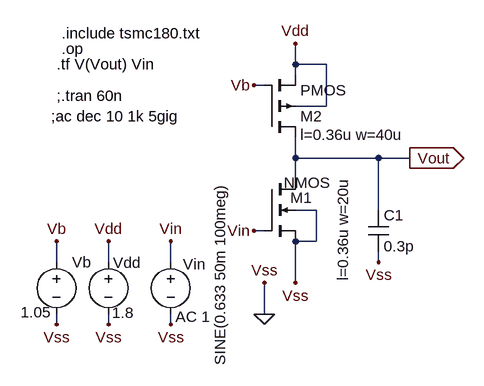
[diagram p0: schematic CS_amp with current source with 1Ghz.asc]
CS_amp with current source with 1Ghz.asc, the LTspice schematic file:
Version 4
SHEET 1 1056 680
WIRE 496 -96 496 -128
WIRE 544 -96 496 -96
WIRE 496 -80 496 -96
WIRE 448 -64 432 -64
WIRE 544 -32 544 -96
WIRE 544 -32 496 -32
WIRE 496 48 496 16
WIRE 624 48 496 48
WIRE 672 48 624 48
WIRE 496 80 496 48
WIRE 528 128 496 128
WIRE 624 128 624 48
WIRE 448 160 432 160
WIRE 528 176 528 128
WIRE 528 176 496 176
WIRE 128 208 128 176
WIRE 208 208 208 176
WIRE 304 208 304 176
WIRE 624 208 624 192
WIRE 496 240 496 176
WIRE 448 288 448 240
WIRE 128 304 128 288
WIRE 208 304 208 288
WIRE 304 304 304 288
FLAG 448 288 0
FLAG 448 240 Vss
FLAG 304 176 Vin
FLAG 208 304 Vss
FLAG 304 304 Vss
FLAG 208 176 Vdd
FLAG 496 -128 Vdd
FLAG 496 240 Vss
FLAG 672 48 Vout
IOPIN 672 48 Out
FLAG 624 208 Vss
FLAG 432 160 Vin
FLAG 432 -64 Vb
FLAG 128 304 Vss
FLAG 128 176 Vb
SYMBOL nmos4 448 80 R0
WINDOW 0 40 29 Left 2
WINDOW 3 30 6 Left 2
WINDOW 123 121 -2 VRight 2
SYMATTR InstName M1
SYMATTR Value2 l=0.36u w=20u
SYMBOL voltage 208 192 R0
WINDOW 123 0 0 Left 0
WINDOW 39 0 0 Left 0
WINDOW 0 7 17 Left 2
WINDOW 3 6 94 Left 2
SYMATTR InstName Vdd
SYMATTR Value 1.8
SYMBOL voltage 304 192 R0
WINDOW 0 19 19 Left 2
WINDOW 3 76 -106 VRight 2
WINDOW 123 7 100 Left 2
WINDOW 39 0 0 Left 0
SYMATTR InstName Vin
SYMATTR Value SINE(0.633 50m 100meg)
SYMATTR Value2 AC 1
SYMBOL cap 608 128 R0
SYMATTR InstName C1
SYMATTR Value 0.3p
SYMBOL pmos4 448 16 M180
WINDOW 123 56 4 Left 2
SYMATTR Value2 l=0.36u w=40u
SYMATTR InstName M2
SYMBOL voltage 128 192 R0
WINDOW 123 0 0 Left 0
WINDOW 39 0 0 Left 0
WINDOW 3 -55 93 Left 2
SYMATTR Value 1.05
SYMATTR InstName Vb
TEXT 136 -144 Left 2 !.include tsmc180.txt
TEXT 136 -120 Left 2 !.op
TEXT 128 -96 Left 2 !.tf V(Vout) Vin
TEXT 120 -16 Left 2 !;ac dec 10 1k 5gig
TEXT 128 -48 Left 2 !;.tran 60n

The netlist it stands for:
* CS_amp with current source with 1Ghz.asc
M1 Vout Vin 0 0 NMOS l=0.36u w=20u
Vdd Vdd 0 1.8
Vin Vin 0 SINE(0.633 50m 100meg) AC 1
C1 Vout 0 0.3p
M2 Vout Vb Vdd Vdd PMOS l=0.36u w=40u
Vb Vb 0 1.05
.model NMOS NMOS
.model PMOS PMOS
.lib standard.mos
.include tsmc180.txt
.op
.tf V(Vout) Vin
;ac dec 10 1k 5gig
;.tran 60n
.backanno
.end